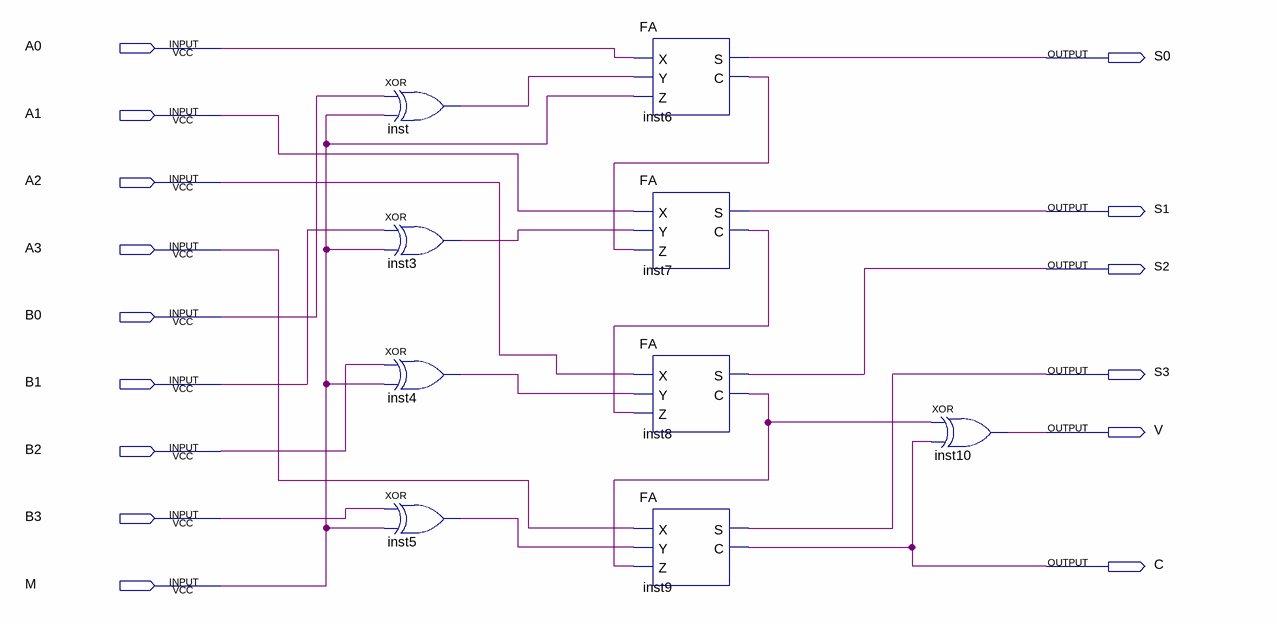
[diagram p0: schematic sheet]
// Quartus schematic 4BA.bdf as structural Verilog: 9 symbols, 15 pins
module \4BA  (
  input  A0,
  input  A1,
  input  A2,
  input  A3,
  input  B0,
  input  B1,
  input  B2,
  input  B3,
  input  M,
  output S0,
  output S1,
  output S2,
  output S3,
  output V,
  output C
);

  wire inst3_out, inst4_out, inst5_out, inst6_c, inst7_c, inst8_c, inst_out;

  xor inst (inst_out, B0, M);
  xor inst3 (inst3_out, B1, M);
  xor inst4 (inst4_out, B2, M);
  xor inst5 (inst5_out, B3, M);
  FA inst6 (.X(A0), .Y(inst_out), .Z(M), .S(S0), .C(inst6_c));
  FA inst7 (.X(A1), .Y(inst3_out), .Z(inst6_c), .S(S1), .C(inst7_c));
  FA inst8 (.X(A2), .Y(inst4_out), .Z(inst7_c), .S(S2), .C(inst8_c));
  FA inst9 (.X(A3), .Y(inst5_out), .Z(inst8_c), .S(S3), .C(C));
  xor inst10 (V, inst8_c, C);
endmodule
